# Altium schematic sheet EPS_MPPT_X_EMI-Filter_Solar-Panels.SchDoc: MPPTX EMI Filters for Solar Panels
size A4; Date: 2015-02-21; Author: Piotr Kuligowski; Revision: 1-0; SheetNumber: 5; SheetTotal: 51; Model: EM1
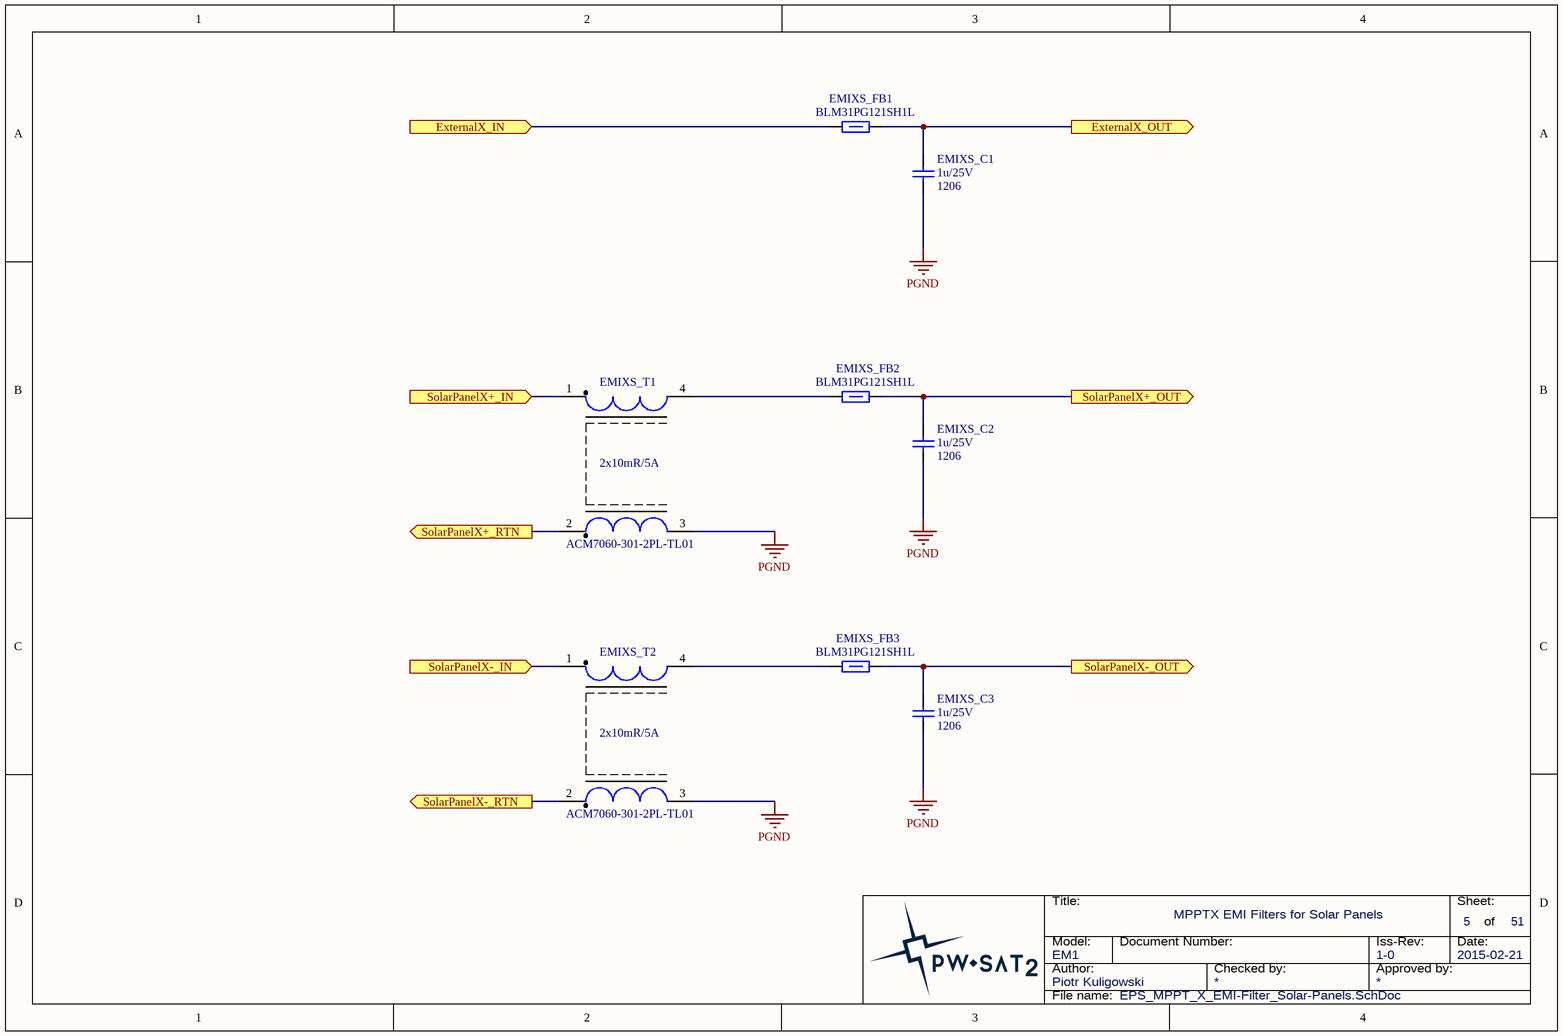
[diagram p0: EPS_MPPT_X_EMI-Filter_Solar-Panels.SchDoc]

## Parts
EMIXS_C1  Package: 1206  [SMD_Capacitor_1206]  (hidden comment: 1u/25V)
EMIXS_C2  Package: 1206  [SMD_Capacitor_1206]  (hidden comment: 1u/25V)
EMIXS_C3  Package: 1206  [SMD_Capacitor_1206]  (hidden comment: 1u/25V)
EMIXS_FB1  120R/100MHz  [SMD_FerriteBead_1206]  (value not drawn)
EMIXS_FB2  120R/100MHz  [SMD_FerriteBead_1206]  (value not drawn)
EMIXS_FB3  120R/100MHz  [SMD_FerriteBead_1206]  (value not drawn)
EMIXS_T1  2x10mR/5A  [TDK_ACM7060]
EMIXS_T2  2x10mR/5A  [TDK_ACM7060]

## Ports
ExternalX_IN (in), ExternalX_OUT (out), SolarPanelX+_IN (in), SolarPanelX+_OUT (out), SolarPanelX+_RTN (out), SolarPanelX-_IN (in), SolarPanelX-_OUT (out), SolarPanelX-_RTN (out)

## Nets
PGND: EMIXS_C1.2 EMIXS_C2.2 EMIXS_C3.2 EMIXS_T1.3 EMIXS_T2.3
ExternalX_IN: EMIXS_FB1.2 ; port ExternalX_IN
ExternalX_OUT: EMIXS_C1.1 EMIXS_FB1.1 ; port ExternalX_OUT
SolarPanelX+_IN: EMIXS_T1.1 ; port SolarPanelX+_IN
SolarPanelX+_OUT: EMIXS_C2.1 EMIXS_FB2.1 ; port SolarPanelX+_OUT
SolarPanelX+_RTN: EMIXS_T1.2 ; port SolarPanelX+_RTN
SolarPanelX-_IN: EMIXS_T2.1 ; port SolarPanelX-_IN
SolarPanelX-_OUT: EMIXS_C3.1 EMIXS_FB3.1 ; port SolarPanelX-_OUT
SolarPanelX-_RTN: EMIXS_T2.2 ; port SolarPanelX-_RTN
NetEMIXS_FB2_2: EMIXS_FB2.2 EMIXS_T1.4
NetEMIXS_FB3_2: EMIXS_FB3.2 EMIXS_T2.4

## Notes on the sheet
- Title:
- Sheet:
- of
- Author:
- Model:
- Document Number:
- Checked by:
- Iss-Rev:
- Approved by:
- Date:
- File name:

## Library data of the parts
EMIXS_C1-EMIXS_C3 = Cer_C1206T105K3RALTU: Ceramic Cap Kemet COTS 1u/25V X7R 1206; ManufacturerPartNumber: C1206T105K3RALTU; Manufacturer: Kemet; Value: 1u/25V
EMIXS_FB1-EMIXS_FB3 = BLM31PG121SH1L: Ferrite bead, 1206, 0.02HM, 3.5A.; Manufacturer: Murata; Current Rating: 3.5A; Series Resistance DC: 0.02R; Package: 1206; Value: 120R/100MHz; ManufacturerPartNumber: BLM31PG121SH1L
EMIXS_T1 EMIXS_T2 = ACM7060-301-2PL-TL01: TDK ACM7060-301 Common Mode Choke; Manufacturer: TDK; ManufacturerPartNumber: ACM7060-301-2PL-TL01; Value: 2x10mR/5A